# Altium schematic sheet Main.SchDoc
size A3; SheetNumber: 1; SheetTotal: 1
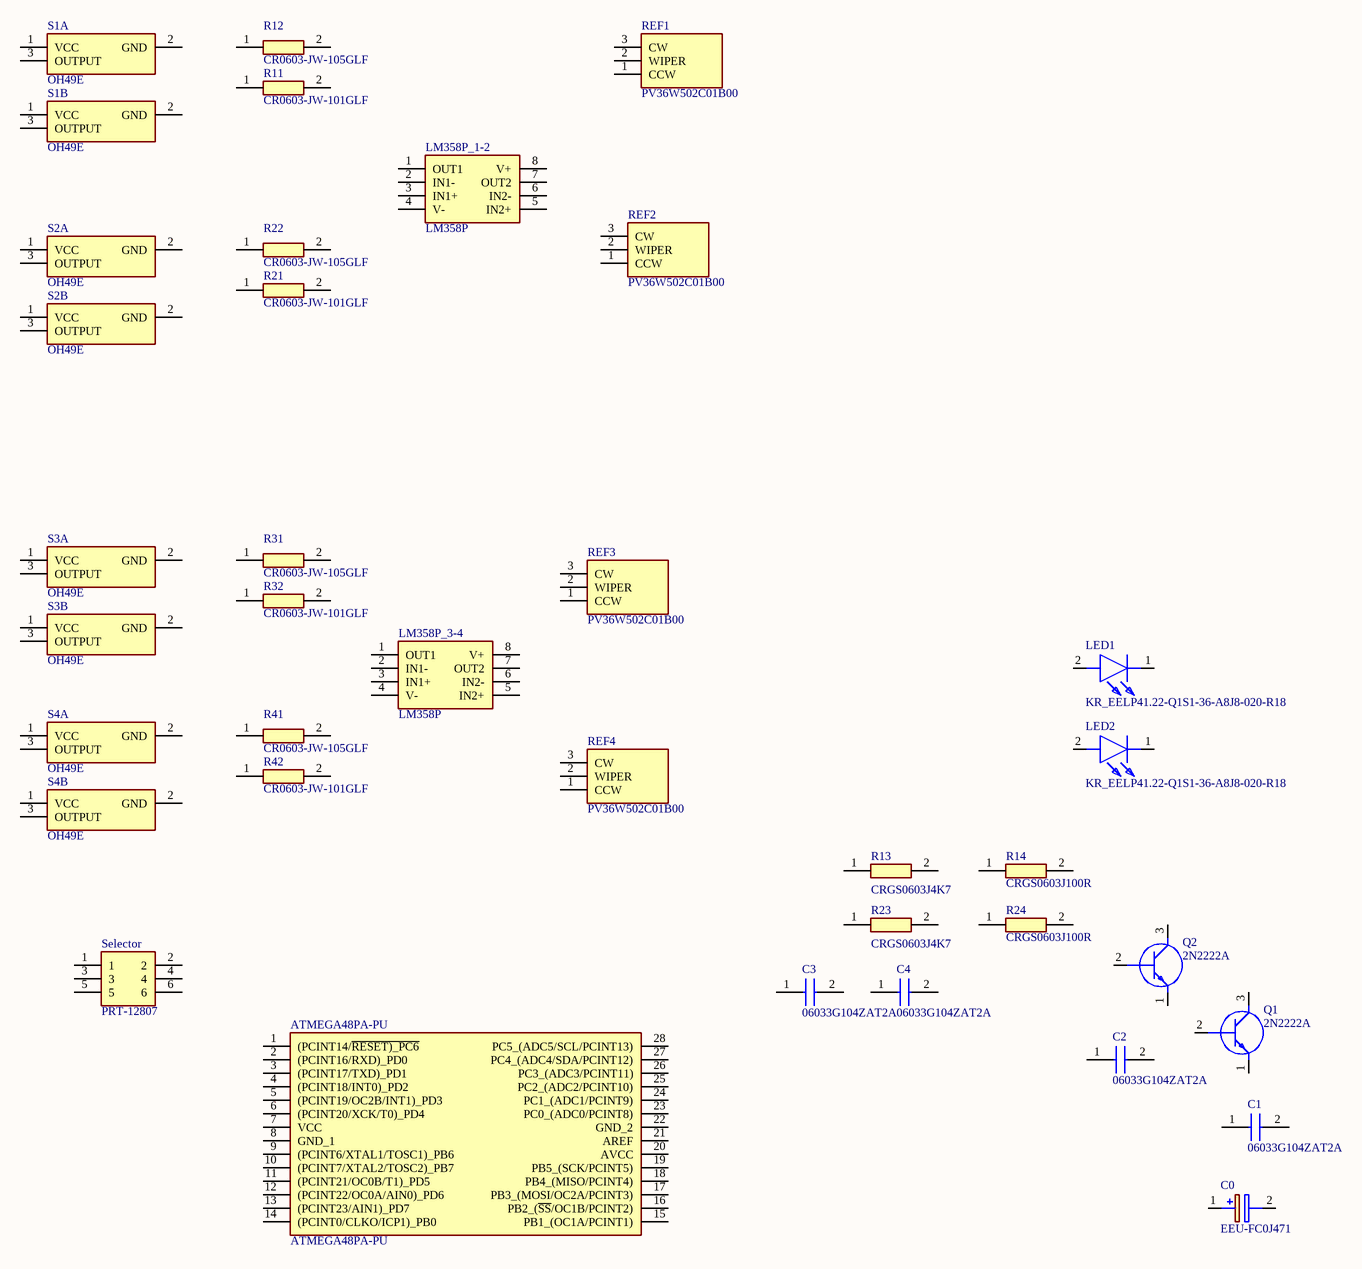
[diagram p0: Main.SchDoc]

## Parts
ATMEGA48PA-PU  ATMEGA48PA-PU  [DIP794W56P254L3486H508Q28N]
C0  EEU-FC0J471  [CAPPRD350W65D800H1250]
C1  06033G104ZAT2A  [CAPC1608X90N]
C2  06033G104ZAT2A  [CAPC1608X90N]
C3  06033G104ZAT2A  [CAPC1608X90N]
C4  06033G104ZAT2A  [CAPC1608X90N]
LED1  KR_EELP41.22-Q1S1-36-A8J8-020-R18  [KREELP4122Q1S136A8J8020R18]
LED2  KR_EELP41.22-Q1S1-36-A8J8-020-R18  [KREELP4122Q1S136A8J8020R18]
LM358P_1-2  LM358P  [DIP794W53P254L959H508Q8N]
LM358P_3-4  LM358P  [DIP794W53P254L959H508Q8N]
Q1  2N2222A  [2N2222A]
Q2  2N2222A  [2N2222A]
R11  CR0603-JW-101GLF  [RESC1608X55N]
R12  CR0603-JW-105GLF  [RESC1608X55N]
R13  CRGS0603J4K7  [RESC1608X55N]
R14  CRGS0603J100R  [RESC1608X55N]
R21  CR0603-JW-101GLF  [RESC1608X55N]
R22  CR0603-JW-105GLF  [RESC1608X55N]
R23  CRGS0603J4K7  [RESC1608X55N]
R24  CRGS0603J100R  [RESC1608X55N]
R31  CR0603-JW-105GLF  [RESC1608X55N]
R32  CR0603-JW-101GLF  [RESC1608X55N]
R41  CR0603-JW-105GLF  [RESC1608X55N]
R42  CR0603-JW-101GLF  [RESC1608X55N]
REF1  PV36W502C01B00  [PV36W502C01B00]
REF2  PV36W502C01B00  [PV36W502C01B00]
REF3  PV36W502C01B00  [PV36W502C01B00]
REF4  PV36W502C01B00  [PV36W502C01B00]
S1A  OH49E  [OH3144]
S1B  OH49E  [OH3144]
S2A  OH49E  [OH3144]
S2B  OH49E  [OH3144]
S3A  OH49E  [OH3144]
S3B  OH49E  [OH3144]
S4A  OH49E  [OH3144]
S4B  OH49E  [OH3144]
Selector  PRT-12807  [HDRV6W82P254_2X3_762X500X884P]

## Nets

Not connected (* = marked no-connect by the designer): ATMEGA48PA-PU 1((PCINT14/~{RESET)_PC6}) 2((PCINT16/RXD)_PD0) 3((PCINT17/TXD)_PD1) 4((PCINT18/INT0)_PD2) 5((PCINT19/OC2B/INT1)_PD3) 6((PCINT20/XCK/T0)_PD4) 7(VCC) 8(GND_1) 9((PCINT6/XTAL1/TOSC1)_PB6) 10((PCINT7/XTAL2/TOSC2)_PB7) 11((PCINT21/OC0B/T1)_PD5) 12((PCINT22/OC0A/AIN0)_PD6) 13((PCINT23/AIN1)_PD7) 14((PCINT0/CLKO/ICP1)_PB0) 15(PB1_(OC1A/PCINT1)) 16(PB2_(~{SS}/OC1B/PCINT2)) 17(PB3_(MOSI/OC2A/PCINT3)) 18(PB4_(MISO/PCINT4)) 19(PB5_(SCK/PCINT5)) 20(AVCC) 21(AREF) 22(GND_2) 23(PC0_(ADC0/PCINT8)) 24(PC1_(ADC1/PCINT9)) 25(PC2_(ADC2/PCINT10)) 26(PC3_(ADC3/PCINT11)) 27(PC4_(ADC4/SDA/PCINT12)) 28(PC5_(ADC5/SCL/PCINT13)); C0 1(+) 2(-); C1 1 2; C2 1 2; C3 1 2; C4 1 2; LED1 1(K) 2(A); LED2 1(K) 2(A); LM358P_1-2 1(OUT1) 2(IN1-) 3(IN1+) 4(V-) 5(IN2+) 6(IN2-) 7(OUT2) 8(V+); LM358P_3-4 1(OUT1) 2(IN1-) 3(IN1+) 4(V-) 5(IN2+) 6(IN2-) 7(OUT2) 8(V+); Q1 1(E) 2(B) 3(C); Q2 1(E) 2(B) 3(C); R11 1 2; R12 1 2; R13 1 2; R14 1 2; R21 1 2; R22 1 2; R23 1 2; R24 1 2; R31 1 2; R32 1 2; R41 1 2; R42 1 2; REF1 1(CCW) 2(WIPER) 3(CW); REF2 1(CCW) 2(WIPER) 3(CW); REF3 1(CCW) 2(WIPER) 3(CW); REF4 1(CCW) 2(WIPER) 3(CW); S1A 1(VCC) 2(GND) 3(OUTPUT); S1B 1(VCC) 2(GND) 3(OUTPUT); S2A 1(VCC) 2(GND) 3(OUTPUT); S2B 1(VCC) 2(GND) 3(OUTPUT); S3A 1(VCC) 2(GND) 3(OUTPUT); S3B 1(VCC) 2(GND) 3(OUTPUT); S4A 1(VCC) 2(GND) 3(OUTPUT); S4B 1(VCC) 2(GND) 3(OUTPUT); Selector 1 2 3 4 5 6

## Library data of the parts
ATMEGA48PA-PU = ATMEGA48PA-PU: Integrated Circuit; Manufacturer_Name: Microchip; Datasheet Link: https://ww1.microchip.com/downloads/en/DeviceDoc/ATmega48A-PA-88A-PA-168A-PA-328-P-DS-DS40002061B.pdf; Height: 5.08mm; Manufacturer_Part_Number: ATMEGA48PA-PU; Mouser Part Number: 556-ATMEGA48PA-PU; Mouser Price/Stock: https://www.mouser.co.uk/ProductDetail/Microchip-Technology/ATMEGA48PA-PU?qs=JV7lzlMm3yJRnpOAnO1k5w%3D%3D; Arrow Part Number: ATMEGA48PA-PU; Arrow Price/Stock: https://www.arrow.com/en/products/atmega48pa-pu/microchip-technology
C0 = EEU-FC0J471: Capacitor Polarised; Manufacturer_Name: Panasonic; Datasheet Link: http://industrial.panasonic.com/cdbs/www-data/pdf/RDF0000/ABA0000C1209.pdf; Height: 12.5mm; Manufacturer_Part_Number: EEU-FC0J471
C1-C4 = 06033G104ZAT2A: Capacitor; Manufacturer_Name: Kyocera AVX; Datasheet Link: https://componentsearchengine.com/Datasheets/1/06031A100FAT2A.pdf; Height: 0.9mm; Manufacturer_Part_Number: 06033G104ZAT2A; Mouser Part Number: 581-06033G104Z; Mouser Price/Stock: https://www.mouser.co.uk/ProductDetail/AVX/06033G104ZAT2A?qs=NXubJDmysXJMPmHfVo6Z%252BA%3D%3D; Arrow Part Number: 06033G104ZAT2A; Arrow Price/Stock: https://www.arrow.com/en/products/06033g104zat2a/avx?region=nac
LED1 LED2 = KR_EELP41.22-Q1S1-36-A8J8-020-R18: LED; Manufacturer_Name: ams OSRAM; Manufacturer_Part_Number: KR EELP41.22-Q1S1-36-A8J8-020-R18; Datasheet Link: https://look.ams-osram.com/m/7eda7e8e2ca21691/original/KR-EELP41-22.pdf; Height: 0.5mm; Mouser Part Number: 720-P412Q1S136A8J802; Mouser Price/Stock: https://www.mouser.co.uk/ProductDetail/ams-OSRAM/KR-EELP41.22-Q1S1-36-A8J8-020-R18?qs=ZcfC38r4PouTxNZSRl%252Bn6g%3D%3D
LM358P_1-2 LM358P_3-4 = LM358P: Integrated Circuit; Manufacturer_Name: Texas Instruments; Datasheet Link: http://www.ti.com/lit/ds/symlink/lm358a.pdf; Height: 5.08mm; Manufacturer_Part_Number: LM358P; Mouser Part Number: 595-LM358P; Mouser Price/Stock: https://www.mouser.co.uk/ProductDetail/Texas-Instruments/LM358P?qs=X1HXWTtiZ0QtOTT8%252BVnsyw%3D%3D; Arrow Part Number: LM358P; Arrow Price/Stock: https://www.arrow.com/en/products/lm358p/texas-instruments?utm_currency=USD&region=nac
Q1 Q2 = 2N2222A: Transistor BJT NPN; Manufacturer_Name: Diotec; Datasheet Link: https://diotec.com/request/datasheet/2n2222a.pdf; Height: 7.5mm; Manufacturer_Part_Number: 2N2222A; Mouser Part Number: 637-2N2222A; Mouser Price/Stock: https://www.mouser.co.uk/ProductDetail/Diotec-Semiconductor/2N2222A?qs=OlC7AqGiEDmNlRSTGL2dYg%3D%3D; Arrow Part Number: 2N2222A; Arrow Price/Stock: https://www.arrow.com/en/products/2n2222a/diotec-semiconductor-ag
R11 R21 R32 R42 = CR0603-JW-101GLF: Resistor; Manufacturer_Name: Bourns; Datasheet Link: https://www.bourns.com/pdfs/chpreztr.pdf; Height: 0.55mm; Manufacturer_Part_Number: CR0603-JW-101GLF; Mouser Part Number: 652-CR0603-JW-101GLF; Mouser Price/Stock: https://www.mouser.co.uk/ProductDetail/Bourns/CR0603-JW-101GLF?qs=QNvGIbmBFefaA8eCtCoMeQ%3D%3D; Arrow Part Number: CR0603-JW-101GLF; Arrow Price/Stock: https://www.arrow.com/en/products/cr0603-jw-101glf/bourns
R12 R22 R31 R41 = CR0603-JW-105GLF: Resistor; Manufacturer_Name: Bourns; Datasheet Link: https://www.bourns.com/pdfs/chpreztr.pdf; Height: 0.55mm; Manufacturer_Part_Number: CR0603-JW-105GLF
R13 R23 = CRGS0603J4K7: Resistor; Manufacturer_Name: TE Connectivity; Datasheet Link: https://www.te.com/commerce/DocumentDelivery/DDEController?Action=srchrtrv&DocNm=9-1773463-8&DocType=Data%20Sheet&DocLang=English&PartCntxt=4-2176243-5&DocFormat=pdf; Height: 0.55mm; Manufacturer_Part_Number: CRGS0603J4K7; Mouser Part Number: 279-CRGS0603J4K7; Mouser Price/Stock: https://www.mouser.co.uk/ProductDetail/TE-Connectivity-Holsworthy/CRGS0603J4K7?qs=Rv6LVDxB0ZrE9JFVS6gejA%3D%3D
R14 R24 = CRGS0603J100R: Resistor; Manufacturer_Name: TE Connectivity; Datasheet Link: https://www.te.com/commerce/DocumentDelivery/DDEController?Action=srchrtrv&DocNm=9-1773463-8&DocType=Data%20Sheet&DocLang=English&PartCntxt=2-2176243-5&DocFormat=pdf; Height: 0.55mm; Manufacturer_Part_Number: CRGS0603J100R; Mouser Part Number: 279-CRGS0603J100R; Mouser Price/Stock: https://www.mouser.com/Search/Refine.aspx?Keyword=279-CRGS0603J100R
REF1-REF4 = PV36W502C01B00: Variable Resistor; Manufacturer_Name: Bourns; Datasheet Link: https://www.mouser.com/datasheet/2/54/pv36-907345.pdf; Height: 11.55mm; Manufacturer_Part_Number: PV36W502C01B00; Mouser Part Number: 81-PV36W502C01B00; Mouser Price/Stock: https://www.mouser.co.uk/ProductDetail/Bourns/PV36W502C01B00?qs=BqPwLKJeIrffwfpi4cR%2Fyg%3D%3D; Arrow Part Number: PV36W502C01B00; Arrow Price/Stock: https://www.arrow.com/en/products/pv36w502c01b00/bourns?utm_currency=USD&region=nac
S1A S1B S2A S2B S3A S3B S4A S4B = OH49E: Integrated Circuit; Manufacturer_Name: Ouzhuo; Height: 3.28mm; Manufacturer_Part_Number: OH49E
Selector = PRT-12807: Connector; Manufacturer_Name: SparkFun; Datasheet Link: https://cdn.sparkfun.com/datasheets/Prototyping/00989.pdf; Height: 8.84mm; Manufacturer_Part_Number: PRT-12807; Mouser Part Number: 474-PRT-12807; Mouser Price/Stock: https://www.mouser.co.uk/ProductDetail/SparkFun/PRT-12807?qs=WyAARYrbSnYnpz4kKzOm4A%3D%3D; Arrow Part Number: PRT-12807; Arrow Price/Stock: https://www.arrow.com/en/products/prt-12807/sparkfun-electronics